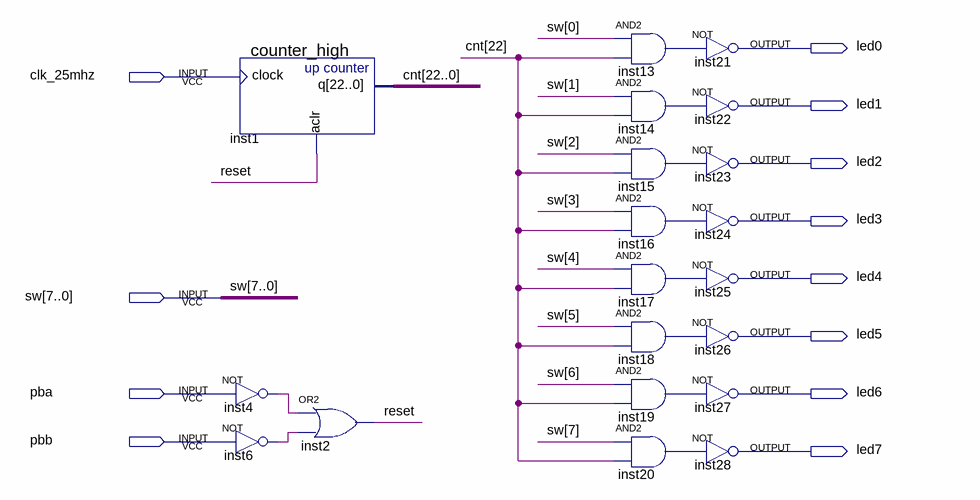
[diagram p0: schematic sheet]
// Quartus schematic lab1.bdf as structural Verilog: 20 symbols, 12 pins
module lab1 (
  input  clk_25mhz,
  input  [7:0] sw,
  input  pba,
  input  pbb,
  output led0,
  output led1,
  output led2,
  output led3,
  output led4,
  output led5,
  output led6,
  output led7
);

  wire inst4_out, inst6_out, inst13_out, inst14_out, inst15_out, inst16_out, inst17_out, inst18_out,
       inst19_out, inst20_out, reset;
  wire [22:0] cnt;

  counter_high inst1 (.clock(clk_25mhz), .aclr(reset), .q(cnt));
  not inst4 (inst4_out, pba);
  not inst6 (inst6_out, pbb);
  or inst2 (reset, inst4_out, inst6_out);
  and inst13 (inst13_out, sw[0], cnt[22]);
  and inst14 (inst14_out, sw[1], cnt[22]);
  and inst15 (inst15_out, sw[2], cnt[22]);
  and inst16 (inst16_out, sw[3], cnt[22]);
  and inst17 (inst17_out, sw[4], cnt[22]);
  and inst18 (inst18_out, sw[5], cnt[22]);
  and inst19 (inst19_out, sw[6], cnt[22]);
  and inst20 (inst20_out, sw[7], cnt[22]);
  not inst21 (led0, inst13_out);
  not inst22 (led1, inst14_out);
  not inst23 (led2, inst15_out);
  not inst24 (led3, inst16_out);
  not inst25 (led4, inst17_out);
  not inst26 (led5, inst18_out);
  not inst27 (led6, inst19_out);
  not inst28 (led7, inst20_out);
endmodule
